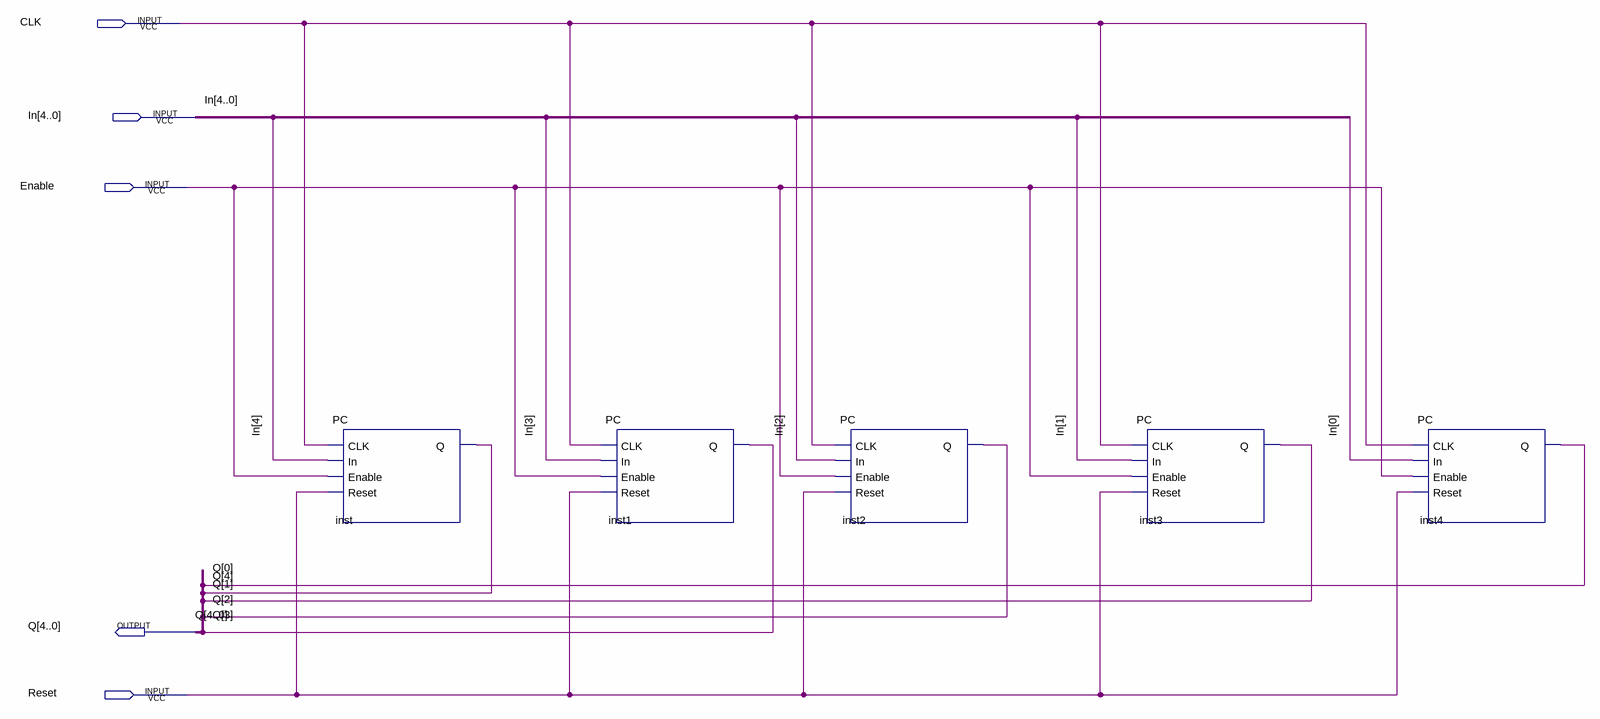
[diagram p0: schematic sheet]
// Quartus schematic Register_5bit.bdf as structural Verilog: 5 symbols, 5 pins
module Register_5bit (
  input  CLK,
  input  [4:0] In,
  input  Enable,
  input  Reset,
  output [4:0] Q
);

  PC inst (.CLK(CLK), .In(In[4]), .Enable(Enable), .Reset(Reset), .Q(Q[4]));
  PC inst1 (.CLK(CLK), .In(In[3]), .Enable(Enable), .Reset(Reset), .Q(Q[3]));
  PC inst2 (.CLK(CLK), .In(In[2]), .Enable(Enable), .Reset(Reset), .Q(Q[2]));
  PC inst3 (.CLK(CLK), .In(In[1]), .Enable(Enable), .Reset(Reset), .Q(Q[1]));
  PC inst4 (.CLK(CLK), .In(In[0]), .Enable(Enable), .Reset(Reset), .Q(Q[0]));
endmodule
